# Altium project Z30_POWER_V1.0.PrjPcb
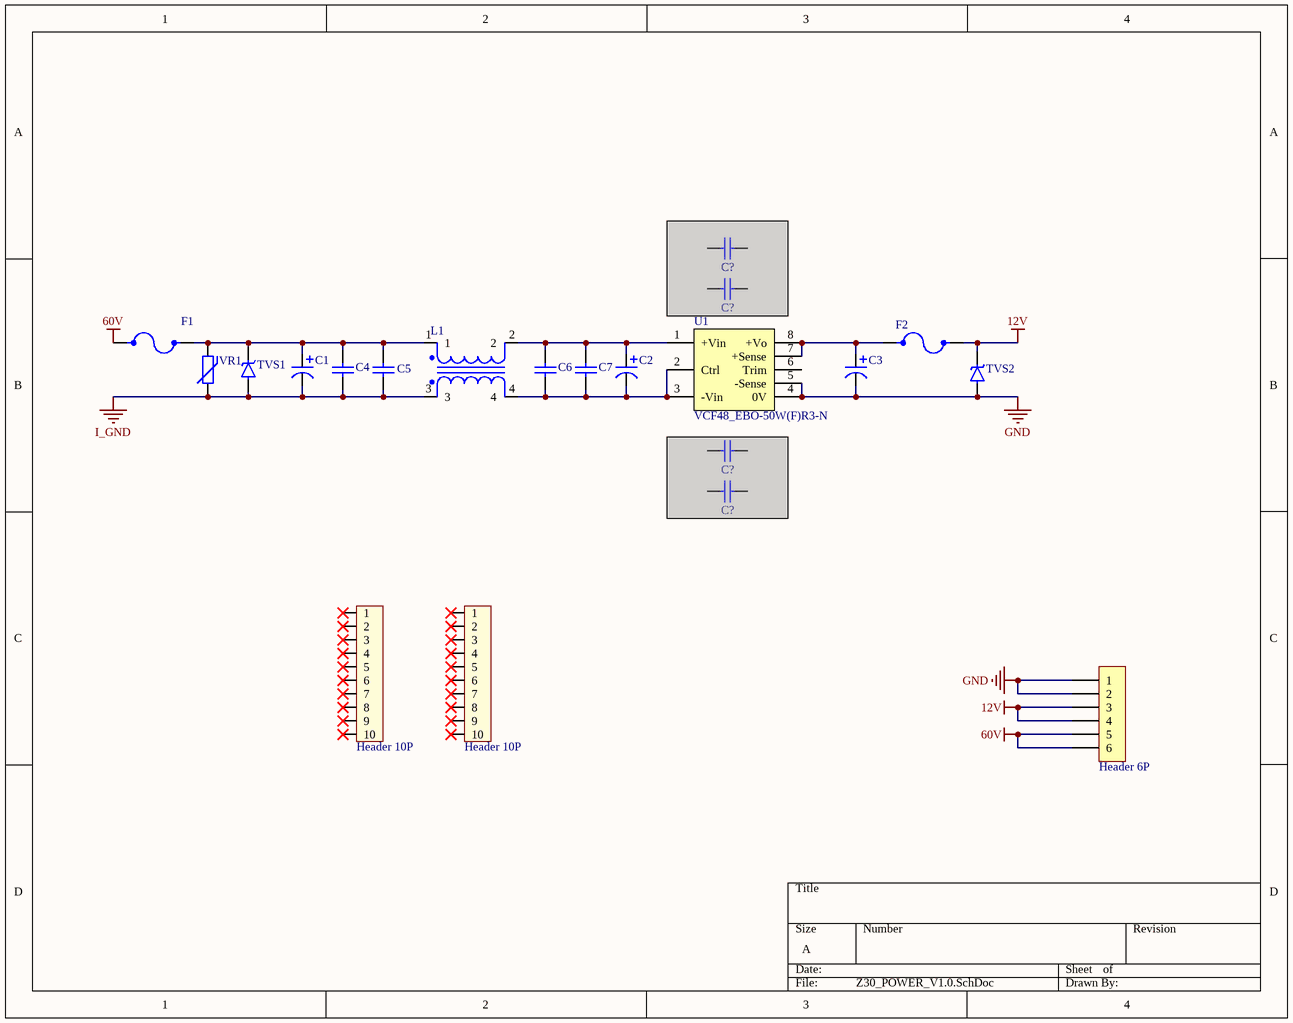
[diagram p0: Z30_POWER_V1.0.SchDoc]
1 sheet, 22 parts. Net scope: global (net labels, ports and power ports of the same name join across sheets).
Board file: Z30_POWER_V1.0.PcbDoc

## Sheet Z30_POWER_V1.0.SchDoc
size A; SheetNumber: 1; SheetTotal: 1

### Parts
(Parts that share a designator on the sheet are numbered #1, #2 ... from top to bottom, then left to right.)
C1  470uF 100V  [1206_CAP]  (value not drawn)
C2  100uF 100V  [1206_CAP]  (value not drawn)
C3  330uF 63V  [1206_CAP]  (value not drawn)
C4  4.7uF 100V  [0603_Cap]  (value not drawn)
C5  4.7uF 100V  [0603_Cap]  (value not drawn)
C6  4.7uF 100V  [0603_Cap]  (value not drawn)
C7  4.7uF 100V  [0603_Cap]  (value not drawn)
C?#1  2.2nF 2KV  [0603_Cap]  (value not drawn)  (masked out: inside a compile mask, not in the netlist)
C?#2  2.2nF 2KV  [0603_Cap]  (value not drawn)  (masked out: inside a compile mask, not in the netlist)
C?#3  2.2nF 2KV  [0603_Cap]  (value not drawn)  (masked out: inside a compile mask, not in the netlist)
C?#4  2.2nF 2KV  [0603_Cap]  (value not drawn)  (masked out: inside a compile mask, not in the netlist)
C?#5  2.2nF 2KV  [0603_Cap]  (value not drawn)  (masked out: inside a compile mask, not in the netlist)
F1  C2680600  [1206_Fuse]  (value not drawn)
F2  C268786  [1206_Fuse]  (value not drawn)
H1  Header 10P  [JP 1X10]
H2  Header 10P  [JP 1X10]
H3  Header 6P  [JP 1X6]
L1  C5116083  [Double inductor]  (value not drawn)
TVS1  SMCJ75A  [SMC - DO-214]  (value not drawn)
TVS2  SMBJ12A  [SMB - DO-214AA]  (value not drawn)
U1  VCF48_EBO-50W(F)R3-N
VR1  C1527610  [Varistor]  (value not drawn)

### Nets
12V: F2.2 H3.3 H3.4 TVS2.1
60V: F1.1 H3.5 H3.6
GND: C3.2 H3.1 H3.2 TVS2.2 U1.4(0V) U1.5(-Sense)
I_GND: C1.2 C4.2 C5.2 L1.3 TVS1.2 VR1.1
NetC1_1: C1.1 C4.1 C5.1 F1.2 L1.1 TVS1.1 VR1.2
NetC2_1: C2.1 C6.1 C7.1 L1.2 U1.1(+Vin)
NetC2_2: C2.2 C6.2 C7.2 L1.4 U1.2(Ctrl) U1.3(-Vin)
NetC3_1: C3.1 F2.1 U1.7(+Sense) U1.8(+Vo)

Not connected (* = marked no-connect by the designer): H1 1* 2* 3* 4* 5* 6* 7* 8* 9* 10*; H2 1* 2* 3* 4* 5* 6* 7* 8* 9* 10*; U1 6(Trim)

### Library data of the parts
C1 = Polarized Capacitor
C2 = Polarized Capacitor: C962160
C3 = Polarized Capacitor: C336712,D10xL10.2
C4-C7 = Ceramic Capacitor: C381466; Chung_Loai: Dán; Don_Vi: Con; So_Chan: 2; Ten_Linh_Kien: Tụ 0805 104-100nF 10% 50V; Ma_Hang: MH004551; Kieu_Chan: *
C?#1-C?#5 = Ceramic Capacitor: Chung_Loai: Dán; Don_Vi: Con; So_Chan: 2; Ten_Linh_Kien: Tụ 0805 104-100nF 10% 50V; Ma_Hang: MH004551; Kieu_Chan: *
F1 = Fuse: / 130V 1.35A 10A 2.7A Plugin Resettable Fuses ROHS /; MP: MF-NSML260/12-2; MF: Bourns Inc.; Check_prices: https://www.snapeda.com/parts/MF-NSML260/12-2/Bourns/view-part/6238260/?ref=eda; Package: None; Value: *; Availability: In Stock; SnapEDA_Link: https://www.snapeda.com/parts/MF-NSML260/12-2/Bourns/view-part/6238260/?ref=snap; Price: None
F2 = Fuse: 16V 4A 100A 8A Plugin Resettable Fuses ROHS; MP: MF-NSML260/12-2; MF: Bourns Inc.; Check_prices: https://www.snapeda.com/parts/MF-NSML260/12-2/Bourns/view-part/6238260/?ref=eda; Package: None; Value: *; Availability: In Stock; SnapEDA_Link: https://www.snapeda.com/parts/MF-NSML260/12-2/Bourns/view-part/6238260/?ref=snap; Price: None
H1 H2 = Header 10P: THT; Ten_Linh_Kien: Header 10P XH2.54-10P Đực Thẳng; Don_Vi: Con; Ma_Hang: MH001286; Chung_Loai: Cắm
H3 = Header 6P: THT; Ten_Linh_Kien: Header 6P XH2.54-6P Đực Cong; Don_Vi: Con; Ma_Hang: MH003363; Chung_Loai: Cắm
L1 = inductor_1: 2mH 100Ω@10KHz 10mΩ 2 SMD,13x18.2mm Common Mode Filters ROHS /
TVS1 = TVS Uni Diode: uni direction, 75A
TVS2 = TVS Uni Diode
VR1 = Varistor